# Altium project EQ_Proyecto.PrjPCB
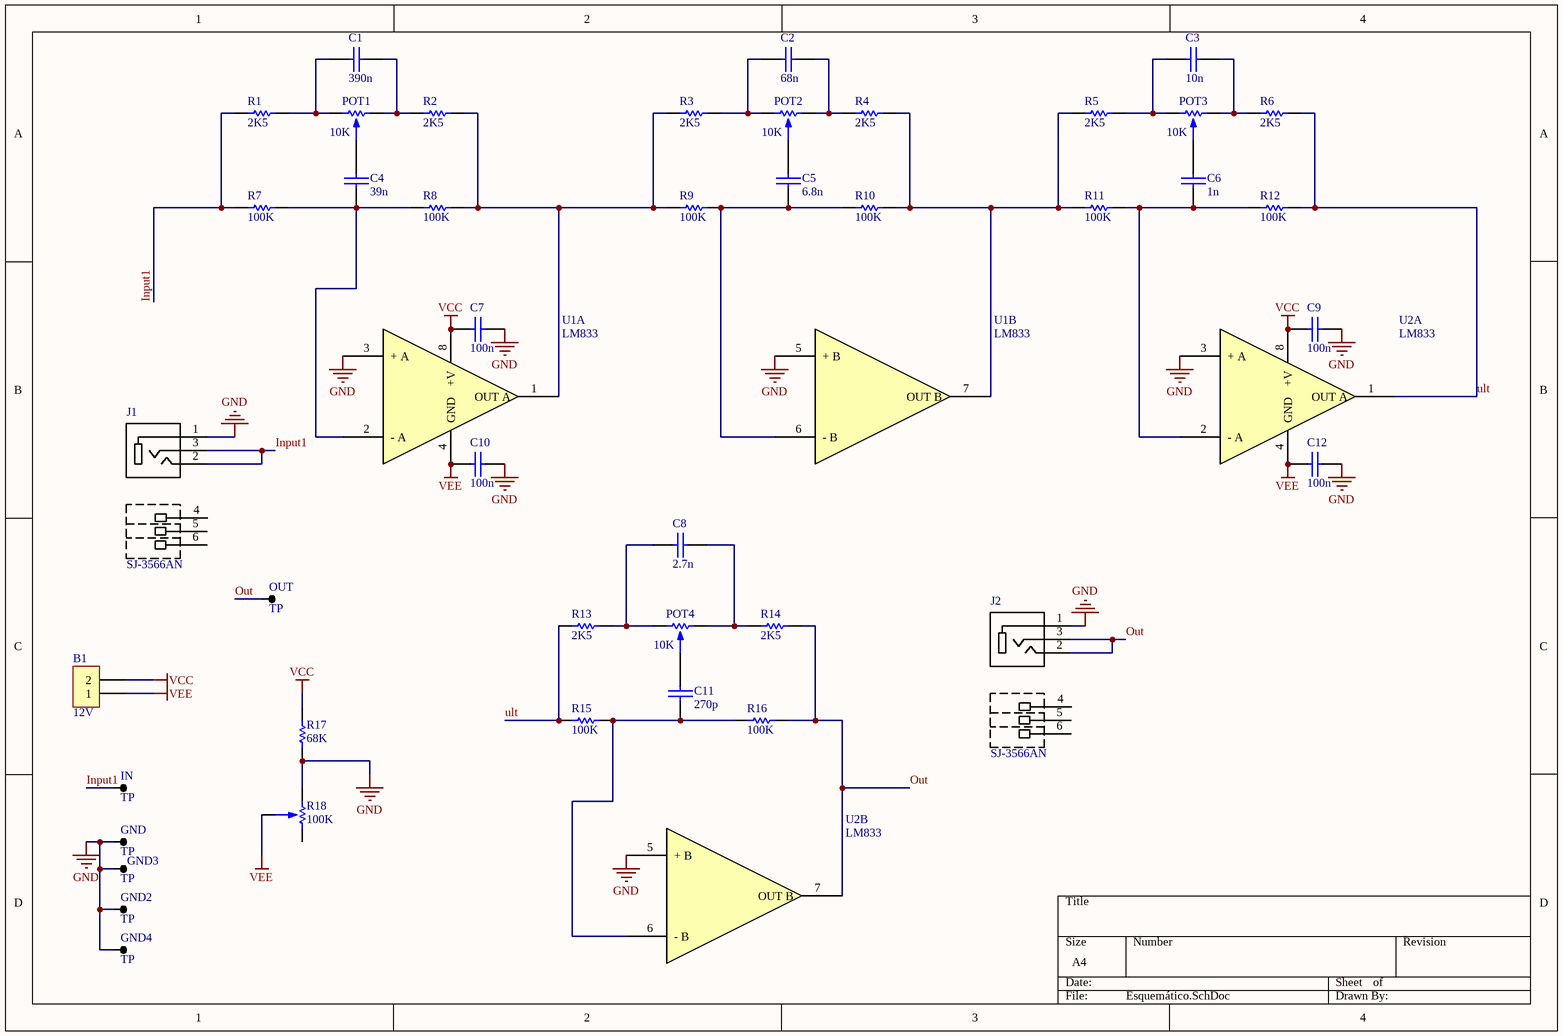
[diagram p0: Esquemático.SchDoc]
1 sheet, 45 parts. Net scope: global (net labels, ports and power ports of the same name join across sheets).
Board file: PCB.PcbDoc

## Sheet Esquemático.SchDoc
size A4

### Parts
B1  12V  [BORNERA2]
C1  390n  [CAP200]
C2  68n  [CAP200]
C3  10n  [CAP200]
C4  39n  [CAP200]
C5  6.8n  [CAP200]
C6  1n  [CAP200]
C7  100n  [CAP200]
C8  2.7n  [CAP200]
C9  100n  [CAP200]
C10  100n  [CAP200]
C11  270p  [CAP200]
C12  100n  [CAP200]
GND  TP  [TPTH]
GND2  TP  [TPTH]
GND3  TP  [TPTH]
GND4  TP  [TPTH]
IN  TP  [TPTH]
J1  SJ-3566AN  [*CUI_SJ-3566AN]
J2  SJ-3566AN  [*CUI_SJ-3566AN]
OUT  TP  [TPTH]
POT1  10K  [POTENCIOMETRO]
POT2  10K  [POTENCIOMETRO]
POT3  10K  [POTENCIOMETRO]
POT4  10K  [POTENCIOMETRO]
R1  2K5  [RES400]
R2  2K5  [RES400]
R3  2K5  [RES400]
R4  2K5  [RES400]
R5  2K5  [RES400]
R6  2K5  [RES400]
R7  100K  [RES400]
R8  100K  [RES400]
R9  100K  [RES400]
R10  100K  [RES400]
R11  100K  [RES400]
R12  100K  [RES400]
R13  2K5  [RES400]
R14  2K5  [RES400]
R15  100K  [RES400]
R16  100K  [RES400]
R17  68K  [RES400]
R18  100K  [PRESET H]
U1  LM833  [DIP8]  (parts A,B of 2)
U2  LM833  [DIP8]  (parts A,B of 2)

### Nets
GND: C7.2 C9.2 C10.2 C12.2 GND.1 GND2.1 GND3.1 GND4.1 J1.1 J2.1 R17.1 R18.3 U1.3(+_A) U1.5(+_B) U2.3(+_A) U2.5(+_B)
VCC: B1.2 C7.1 C9.1 R17.2 U1.8(+V) U2.8(+V)
VEE: B1.1 C10.1 C12.1 R18.2 U1.4(GND) U2.4(GND)
Input1: IN.1 J1.2 J1.3 R1.1 R7.1
Out: J2.2 J2.3 OUT.1 R14.2 R16.2 U2.7(OUT_B)
ult: R6.2 R12.2 R13.1 R15.1 U2.1(OUT_A)
NetC1_1: C1.1 POT1.3 R1.2
NetC1_2: C1.2 POT1.1 R2.1
NetC2_1: C2.1 POT2.3 R3.2
NetC2_2: C2.2 POT2.1 R4.1
NetC3_1: C3.1 POT3.3 R5.2
NetC3_2: C3.2 POT3.1 R6.1
NetC4_1: C4.1 POT1.2
NetC4_2: C4.2 R7.2 R8.1 U1.2(-_A)
NetC5_1: C5.1 POT2.2
NetC5_2: C5.2 R9.2 R10.1 U1.6(-_B)
NetC6_1: C6.1 POT3.2
NetC6_2: C6.2 R11.2 R12.1 U2.2(-_A)
NetC8_1: C8.1 POT4.3 R13.2
NetC8_2: C8.2 POT4.1 R14.1
NetC11_1: C11.1 POT4.2
NetC11_2: C11.2 R15.2 R16.1 U2.6(-_B)
NetR2_2: R2.2 R3.1 R8.2 R9.1 U1.1(OUT_A)
NetR4_2: R4.2 R5.1 R10.2 R11.1 U1.7(OUT_B)

Not connected (* = marked no-connect by the designer): J1 4 5 6; J2 4 5 6; R18 1

### Library data of the parts
B1 = BORNERA 2
C1-C12 = CAP
J1 J2 = SJ-3566AN: 3.5 mm, Stereo, Right Angle, Through Hole, SPDT Switch, Audio Jack Connector; MF: CUI Inc.; Package: None; Digi-Key_Part_Number: CP-SJ-3566AN-ND; CUI_purchase_URL: https://www.cui.com/product/interconnect/connectors/audio-connectors/jacks/sj-356xn-series?utm_source=snapeda.com&utm_medium=referral&utm_campaign=snapedaBOM; MP: SJ-3566AN; SnapEDA_Link: https://www.snapeda.com/parts/SJ-3566AN/CUI%20Inc./view-part/?ref=snap; Digi-Key_Purchase_URL: https://www.digikey.com/product-detail/en/cui-inc/SJ-3566AN/CP-SJ-3566AN-ND/305112?utm_source=snapeda&utm_medium=aggregator&utm_campaign=symbol; Value: *
POT1-POT4 = POTENCIOMETRO
R1-R17 = RES
R18 = PRESET
U1 U2 = LM833: Dual Audio Operational Amplifier